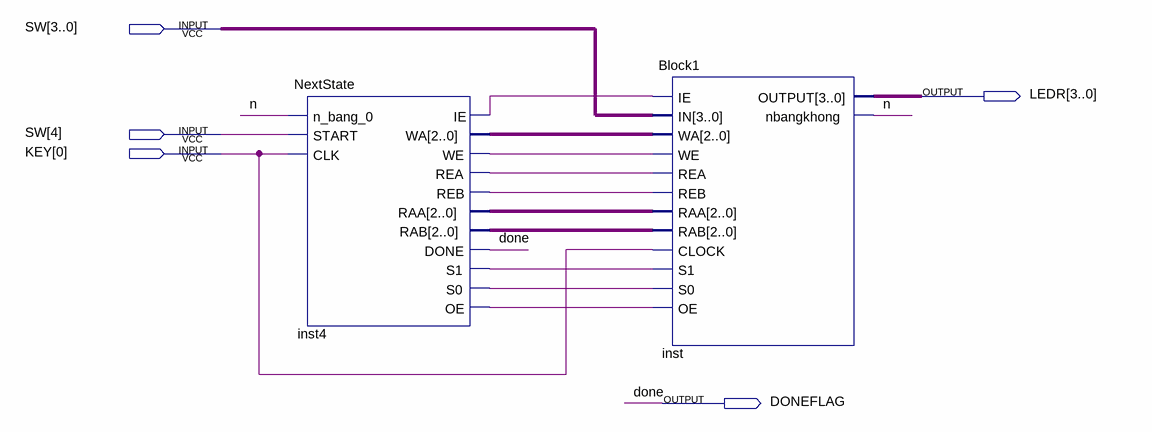
[diagram p0: schematic sheet]
// Quartus schematic FULL.bdf as structural Verilog: 2 symbols, 5 pins
module FULL (
  input  [4:0] SW,
  input  [0:0] KEY,
  output [3:0] LEDR,
  output DONEFLAG
);

  wire inst4_ie, inst4_oe, inst4_rea, inst4_reb, inst4_s0, inst4_s1, inst4_we, n;
  wire [2:0] inst4_raa, inst4_rab, inst4_wa;

  NextState inst4 (
    .n_bang_0(n), .START(SW[4]), .CLK(KEY[0]), .IE(inst4_ie), .WA(inst4_wa), .WE(inst4_we), .REA(inst4_rea),
    .REB(inst4_reb), .RAA(inst4_raa), .RAB(inst4_rab), .DONE(DONEFLAG), .S1(inst4_s1), .S0(inst4_s0),
    .OE(inst4_oe));
  Block1 inst (
    .IE(inst4_ie), .IN(SW[3:0]), .WA(inst4_wa), .WE(inst4_we), .REA(inst4_rea), .REB(inst4_reb),
    .RAA(inst4_raa), .RAB(inst4_rab), .CLOCK(KEY[0]), .S1(inst4_s1), .S0(inst4_s0), .OE(inst4_oe),
    .OUTPUT(LEDR), .nbangkhong(n));

  // Other names for the same wires on the sheet: done = DONEFLAG
endmodule
